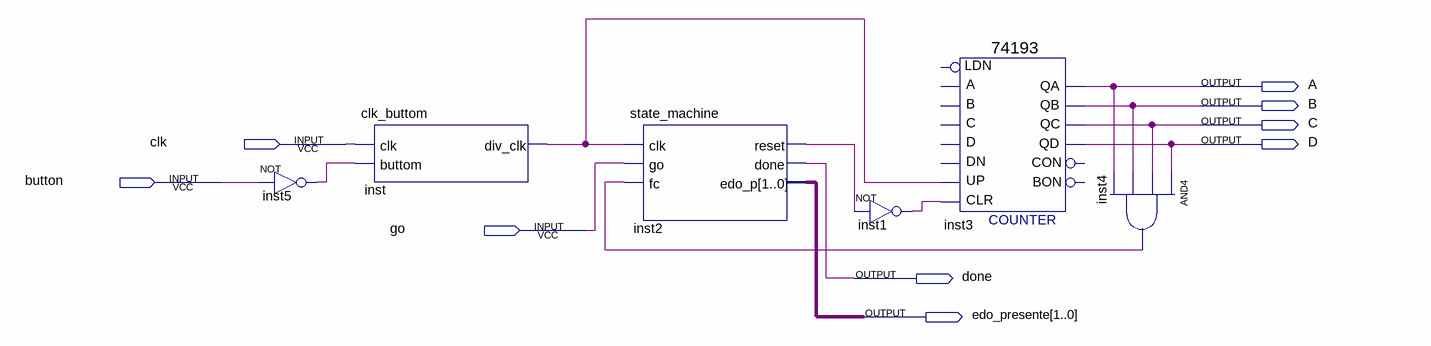
[diagram p0: schematic sheet]
// Quartus schematic practica2_2.bdf as structural Verilog: 6 symbols, 9 pins
module practica2_2 (
  input  clk,
  input  button,
  input  go,
  output A,
  output B,
  output C,
  output D,
  output done,
  output [1:0] edo_presente
);

  wire inst1_out, inst2_reset, inst4_out, inst5_out, inst_div_clk;

  not inst5 (inst5_out, button);
  clk_buttom inst (.clk(clk), .buttom(inst5_out), .div_clk(inst_div_clk));
  state_machine inst2 (
    .clk(inst_div_clk), .go(go), .fc(inst4_out), .reset(inst2_reset), .done(done), .edo_p(edo_presente));
  not inst1 (inst1_out, inst2_reset);
  \74193  inst3 (
    .CLR(inst1_out), .UP(inst_div_clk), .QB(B), .QA(A), .QD(D), .QC(C));  // open: D, C, B, A, DN, LDN, CON, BON
  and inst4 (inst4_out, D, C, B, A);
endmodule
